# Altium project Irrigation_System.PrjPcb
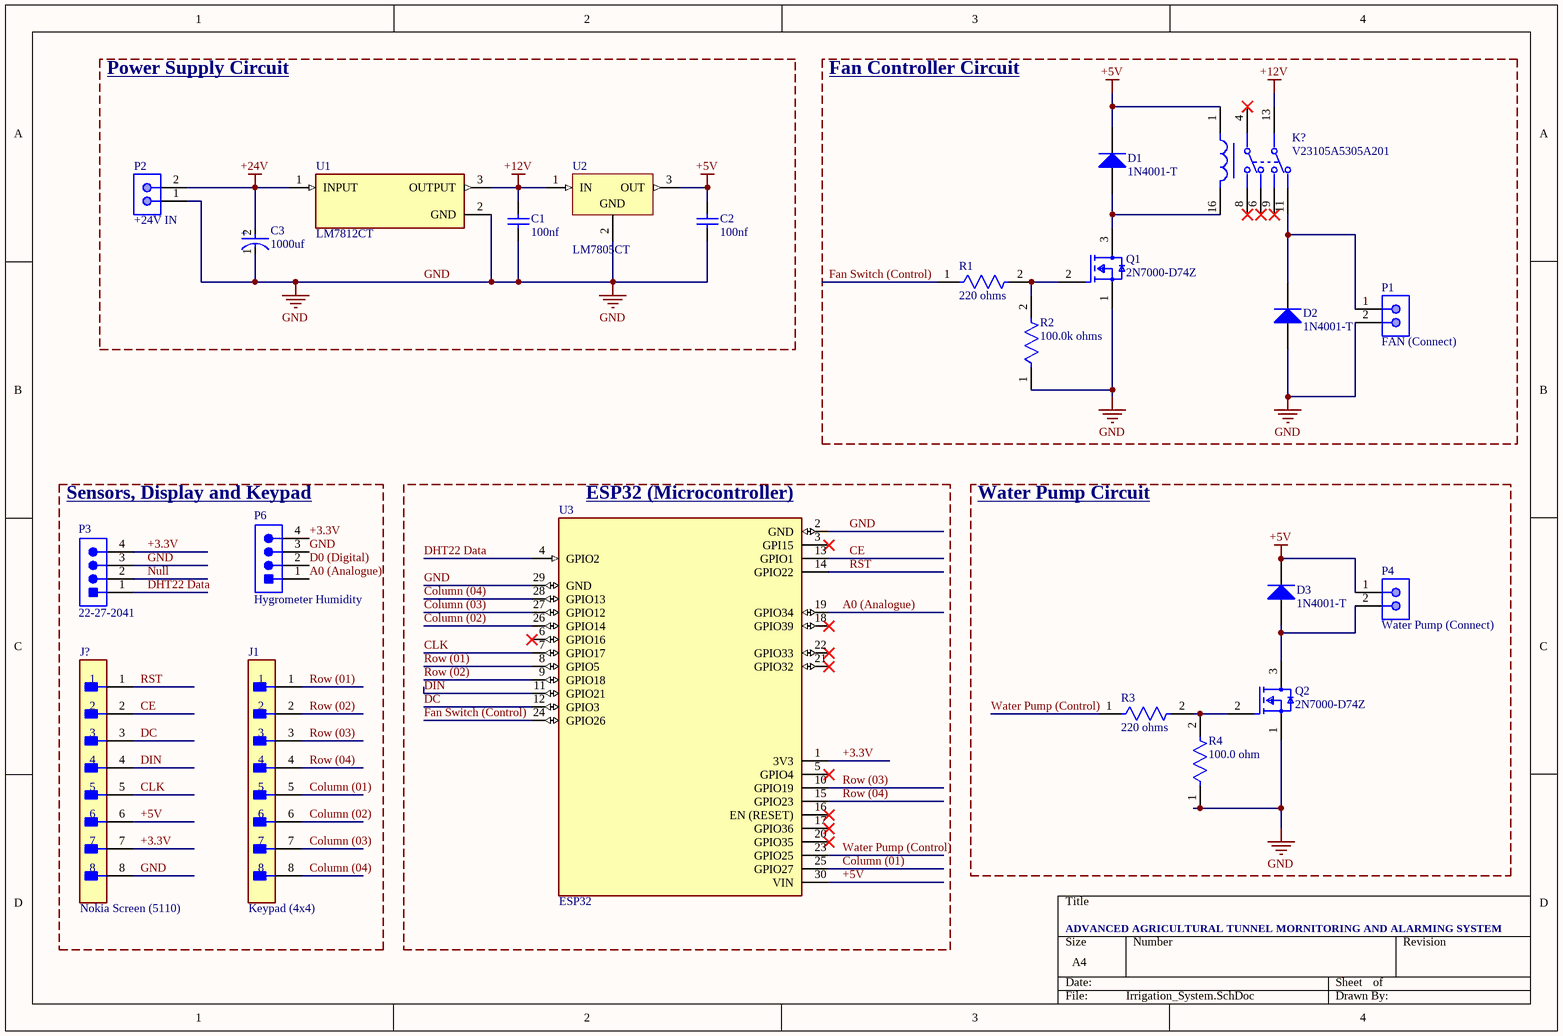
[diagram p0: Irrigation_System.SchDoc]
1 sheet, 23 parts. Net scope: global (net labels, ports and power ports of the same name join across sheets).
Board file: Irrigation_System.PcbDoc

## Sheet Irrigation_System.SchDoc
size A4; SheetNumber: 1; SheetTotal: 1

### Parts
C1  100nf  [CAPR51-254-508X318X736]
C2  100nf  [CAPR51-254-508X318X736]
C3  1000uf  [FP-RAD-TH-D_16_0_5-L_25_2-MFG]
D1  1N4001-T  [DIOD-DO-41-P-2_V]
D2  1N4001-T  [DIOD-DO-41-P-2_V]
D3  1N4001-T  [DIOD-DO-41-P-2_V]
J1  Keypad (4x4)  [FP-22-29-2081-MFG]
J?  Nokia Screen (5110)  [FP-22-29-2081-MFG]
K?  V23105A5305A201  [FP-V23105A5305A201-MFG]
P1  FAN (Connect)  [MOLX-22-27-2021_V]
P2  +24V IN  [MOLX-22-27-2021_V]
P3  22-27-2041  [MOLX-22-27-2041_V]
P4  Water Pump (Connect)  [MOLX-22-27-2021_V]
P6  Hygrometer Humidity  [MOLX-22-27-2041_V]
Q1  2N7000-D74Z  [FP-135AR-MFG]
Q2  2N7000-D74Z  [FP-135AR-MFG]
R1  220 ohms  [FP-MRS25-MFG]
R2  100.0k ohms  [FP-MRS25-MFG]
R3  220 ohms  [FP-MRS25-MFG]
R4  100.0 ohm  [FP-MRS25-MFG]
U1  LM7812CT  [FP-TO220B03-MFG]
U2  LM7805CT  [FAIR-TO-220-3]
U3  ESP32  [XCVR_ESP32-C3-DEVKITC-02]

### Blocks framed on the sheet
Power Supply Circuit: C1-C3 P2 U1 U2
Fan Controller Circuit: D1 D2 K? P1 Q1 R1 R2
Sensors, Display and Keypad: J1 J? P3 P6
ESP32 (Microcontroller): U3
Water Pump Circuit: D3 P4 Q2 R3 R4

### Nets
+5V: C2.2 D1.2(K) D3.2(K) J?.6 K?.1 P4.1 U2.3(OUT) U3.30(VIN)
+12V: C1.2 K?.13 U1.3(OUTPUT) U2.1(IN)
+24V: C3.2(A) P2.2 U1.1(INPUT)
GND: C1.1 C2.1 C3.1(C) D2.1(A) J?.8 P1.2 P2.1 P3.3 P6.3 Q1.1(Source) Q2.1(Source) R2.1 R4.1 U1.2(GND) U2.2(GND) U3.2(GND) U3.29(GND)
+3.3V: J?.7 P3.4 P6.4 U3.1(3V3)
A0 (Analogue): P6.1 U3.19(GPIO34)
CE: J?.2 U3.13(GPIO1)
CLK: J?.5 U3.7(GPIO17)
Column (01): J1.5 U3.25(GPIO27)
Column (02): J1.6 U3.26(GPIO14)
Column (03): J1.7 U3.27(GPIO12)
Column (04): J1.8 U3.28(GPIO13)
D0 (Digital): P6.2
DC: J?.3 U3.12(GPIO3)
DHT22 Data: P3.1 U3.4(GPIO2)
DIN: J?.4 U3.11(GPIO21)
Fan Switch (Control): R1.1 U3.24(GPIO26)
Null: P3.2
Row (01): J1.1 U3.8(GPIO5)
Row (02): J1.2 U3.9(GPIO18)
Row (03): J1.3 U3.10(GPIO19)
Row (04): J1.4 U3.15(GPIO23)
RST: J?.1 U3.14(GPIO22)
Water Pump (Control): R3.1 U3.23(GPIO25)
NetD1_1: D1.1(A) K?.16 Q1.3(Drain)
NetD2_2: D2.2(K) K?.11 P1.1
NetD3_1: D3.1(A) P4.2 Q2.3(Drain)
NetQ1_2: Q1.2(Gate) R1.2 R2.2
NetQ2_2: Q2.2(Gate) R3.2 R4.2

Not connected (* = marked no-connect by the designer): K? 4* 6* 8* 9*; U3 3(GPI15)* 5(GPIO4)* 6(GPIO16)* 16(EN_(RESET))* 17(GPIO36)* 18(GPIO39)* 20(GPIO35)* 21(GPIO32)* 22(GPIO33)*

### Notes on the sheet
- ADVANCED AGRICULTURAL TUNNEL MORNITORING AND ALARMING SYSTEM
- (in symbol CMP-05427-000487-1) +

### Library data of the parts
C1 C2 = CMP-1664-00004-1: Radial Leaded Multilayer Ceramic Capacitor, 0.1 uF, +/- 10%, 50 V, -55 to 125 degC, 2-Pin THD, RoHS, Tape and Reel; Case\Package: SOT-23-5; Max Power Dissipation: 250 mW; Output Current: 150 mA; Dropout Voltage: 260 mV; Outputs: 1; Output Voltage: 5 V; Max Input Voltage: 8 V; Min Operating Temperature: -40 degC; Packaging: Tape and Reel; Height: 1.3 mm; Radiation Hardening: No; Pins: 5; ComponentLink1Description: Manufacturer URL; Mount: Surface Mount; RoHSCompliant: true; Max Operating Temperature: 85 degC; PackageReference: CAPR51-254-508X318X736; ComponentLink2URL: http://www.kemet.com/docfinder?Partnumber=C320C104K5R5TA; PackageDescription: 2-Pin Through Hole Device, Body 5.08 x 3.18 mm, Pitch 2.54 mm; ComponentLink1URL: http://www.kemet.com/; Width: 1.8 mm; Package Quantity: 3000; DatasheetVersion: Dec-15; Length: 3 mm; ComponentLink2Description: Datasheet
C3 = CMP-05427-000487-1: Aluminum Electrolytic Capacitors (Radial Lead Type) 1000uF ±20% 50V; Ripple Current: 3.32A; Impedance: 16mR; Polarity: Polar; Life (Hours): 10000Hour; Capacitance: 1mF; Lead Diameter: 0.8mm; Mount: Through Hole; Series: FR; Package Quantity: 250; Length: 25mm; Radiation Hardening: No; REACH SVHC: No SVHC; Case/Package: Radial; Height: 25mm; Min Operating Temperature: -40°C; Contact Plating: Tin; Lead Free: Lead Free; Height - Seated (Max): 0.984inch; RoHS Compliant: Yes; Features: General Purpose; ESR (Equivalent Series Resistance): 16mR; Voltage Rating: 50V; Diameter: 16mm; Voltage Rating (DC): 50V; Max Operating Temperature: 105°C; Lead Pitch: 7.5mm; Packaging: Tape and Reel; Number of Pins: 2; Tolerance: 20%; Termination: Through Hole
D1-D3 = CMP-0639-00006-2: 1.0 A Rectifier, 15 pF, 50 V, -65 to 150 degC, 2-Pin DO-41 Plastic, RoHS, Tape and Reel; Manufacturer: Diodes Inc; VF (V): 1; CT (pF): 15; Max. IR (uA): 5; VRRM (V): 50; Max. IFSM (A): 30; RoHS: TRUE; Mounting Technology: Through Hole; PartNumber: 1N4001-T; ComponentLink2Description: Datasheet; DatasheetVersion: Rev. 8-2; Operating Temperature Range (degC): -65 to 150; Packing: Tape and Reel; PackageReference: DO-41-P-2; ComponentLink1URL: http://diodes.com/; PackageDescription: 2-Pin Axial Lead, Body 4.635 x 2.36 mm, Lead Spread 25.4 mm; ComponentLink2URL: http://diodes.com/datasheets/ds28002.pdf; Max. Average Rectified Current IO (A): 1; ComponentLink1Description: Manufacturer URL
J1 J? = CMP-00257-00277737-1: 22-29-2081 KK® 254 Wire-to-Board Header, Vertical, with Friction Lock, 8 Circuits, Gold (Au) Plating; NexarPartId: 277737; Contact Resistance: 10mΩ; Voltage Rating: 250V; Number of Positions: 8; Pitch: 2.54mm; Insulation Resistance: 50GΩ; Glow Wire Compliant: Non-compliant; Gender: Male; Current Rating: 4A; Number of Pins: 8; Lead Free: Lead Free; Color: White; Flammability Rating: UL94 V-0; REACH SVHC: Unknown; Height: 11.42mm; Housing Material: Nylon; Contact Plating: Gold; Packaging: Bulk; Min Operating Temperature: -40°C; Number of Contacts: 8; Voltage Rating (DC): 250V; Termination: Through Hole; Number of Rows: 1; Halogen Free: Low Halogen; Contact Material: Brass; Radiation Hardening: No; Max Operating Temperature: 75°C; Orientation: Vertical; Mount: Through Hole; Schedule B: 8536694040; Number of Circuits: 8; RoHS: Compliant; Lead Pitch: 2.54mm
K? = CMP-03395-000159-1: RELAY TELECOM DPDT 3A 24V; Manufacturer: TE Connectivity; Standoff Height: 0.2mm; Coil Type: Non-Latching; Number Of Contacts: 2; Coil Resistance: 2880Ω; Coil Power: 200mW; Switching Current: 3A; Device Class L1: Electromechanical; Automotive: No; Octopart: https://octopart.com/9-1393792-9-te+connectivity-41176539; Manufacturer Part Number: V23105A5305A201; ComponentLink2URL: https://www.te.com/commerce/DocumentDelivery/DDEController?Action=showdoc&DocId=Specification+Or+Standard%7F108-98007%7F1017%7Fpdf%7FEnglish%7FENG_SS_108-98007_1017.pdf%7F9-1393792-9; Lead Free: Yes; Temperature: -40°C to +85°C; Current Rating: 3A; Height: 10.9mm; Ambient Temperature Range High: +85°C; Ambient Temperature Range Low: -40°C; Category: Relay; RoHS: TRUE; Digikey Description: RELAY TELECOM DPDT 3A 24V; Package: V23105A5305A201; Device Class L3: Power Relays; Coil Voltage: 24V; Throw Configuration: DPDT; Temperature Range Low: -40°C; ComponentLink2Description: Datasheet; Temperature Range High: +85°C; Device Class L2: Relays
P1 P2 P4 = CMP-2000-05537-1: Male Header, Pitch 2.54 mm, 1 x 2 Position, Height 11.7 mm, Tail Length 3.56 mm, 0 to 75 degC, RoHS, Bulk; Manufacturer: Molex; PartNumber: 0022272021; Current rating: 4A; Package Version: Rev. BC, 02/2012; Voltage rating: 250V; No. of Positions: 2; Pitch: 2.54mm; No. of Rows: 1; Orientation: Vertical; Operating temperature: 0°Cto+75°C; Manufacturer URL: http://www.molex.com/; Mounting Technology: ThroughHole; Housing material: Nylon(UL94V-0); Package Description: 2-Leads Header, Body 5.08 x 5.8 mm, Pitch 2.54 mm; Voltage - Max: 250V; Datasheet URL: http://www.molex.com/pdm_docs/sd/022272021_sd.pdf; Package Reference: 22-27-2021; Contact material: Tinplatedbrass; Current - Max: 4A; Datasheet Version: Rev. F, 06/2009
P3 P6 = CMP-2000-05243-1: Male Header, Pitch 2.54 mm, 1 x 4 Position, Height 11.7 mm, Tail Length 3.56 mm, RoHS, Bulk; Manufacturer: Molex; Voltage rating: 250V; Current rating: 4A; Datasheet Version: Rev. F, 06/2009; Operating temperature: 0degCto+75degC; Contact material: Tinplatedbrass; Manufacturer URL: http://www.molex.com/; Housing material: Nylon(UL94V-0); Datasheet URL: http://www.molex.com/pdm_docs/sd/022272041_sd.pdf
Q1 Q2 = CMP-00278-84793556-1: 2N7000-D74Z 2N7000 Series 60V 5 Ohms N-Ch Enhancement Mode Field Effect Transistor - TO-92; Manufacturer Lifecycle Status: ACTIVE; Drain to Source Resistance: 1.2Ω; Power Dissipation: 400mW; Gate to Source Voltage (Vgs): 20V; Continuous Drain Current (ID): 200mA; Max Junction Temperature (Tj): 150°C; Number of Channels: 1; NexarPartId: 84793556; Min Operating Temperature: -55°C; Height: 8.77mm; Drain to Source Breakdown Voltage: 60V; RoHS: Compliant; Max Operating Temperature: 150°C; Lifecycle Status: Production; Schedule B: 8541210080; Drain to Source Voltage (Vdss): 60V
R1-R4 = CMP-00030-42632392-1: MRS25000C1002FCT00 Resistor, 10 kOhm, ± 1%, 600 mW, Axial Leaded, Metal Film (Thin Film), Professional; Power Rating: 600mW; Voltage Rating (DC): 350V; Lead Length: 26mm; Resistance: 10kΩ; Temperature Coefficient: 50ppm/°C; Termination: Axial; Number of Terminations: 2; Diameter: 2.5mm; Composition: Metal Film, Thin Film; Number of Pins: 2; Length: 6.5mm; Military Standard: Not; RoHS: Compliant; NexarPartId: 42632392; Width: 2.5mm; Radiation Hardening: No; Voltage Rating: 350V; Max Power Dissipation: 600mW; Min Operating Temperature: -55°C; Lead Free: Lead Free; Max Operating Temperature: 155°C; Tolerance: 1%; Schedule B: 8533210090, 8533210090; Contact Plating: Tin; Mount: Through Hole; REACH SVHC: Unknown; Case/Package: Conformal
U1 = CMP-07128-000015-1: IC REG LINEAR 12V 1A TO220-3; Obsolete Part: true; Manufacturer: ON Semiconductor; Nominal Supply Current: 5.1mA; Output Type: Fixed; Dropout Voltage: 2V; Max Supply Voltage: 35V; Accuracy Percentage: 4%; Standoff Height: 2.7mm; Number Of Outputs: 1; Octopart: https://octopart.com/lm7812ct-on+semiconductor-14383031; Output Current: 1A; ComponentLink2Description: Datasheet; Device Class L1: Integrated Circuits (ICs); Device Class L2: Power Management ICs; Temperature Range Low: -40°C; Category: IC; Package: TO220B03; Device Class L3: Voltage Regulators - Linear; RoHS: TRUE; Digikey Description: IC REG LINEAR 12V 1A TO220-3; Ipc Land Pattern Name: TO-220; Output Voltage: 12V; Temperature: -40°C to +125°C; Automotive: No; Temperature Range High: +125°C; ComponentLink2URL: https://www.mouser.in/datasheet/2/308/LM7812-1125088.pdf; Manufacturer Part Number: LM7812CT; Height: 20.4mm; Lead Free: Yes
U2 = CMP-2000-04938-1: Positive Voltage Regulator, 5 V, 1 A, -40 to 125 degC, 3-Pin TO-220, RoHS, Tube; Manufacturer: FairchildSemiconductor; Maximum Input Voltage: 35V; Maximum Quiescent Current: 8mA; Load Regulation: 100mV; Maximum Output Current: 2.2(Typ)A; Output Type: Fixed; Typical Dropout Voltage @ Current: 2@1AV; Rad Hard: No; Output Voltage: 5V; Accuracy: ±4%; Number of Outputs: 1; Category: LinearRegulator; Package Description: 3-Pin Through Hole Device, Body 10 x 4.5 mm, Pitch 2.54 mm; Packaging: Rail/Tube; Mounting: ThroughHole; Polarity: Positive; Manufacturer URL: https://www.fairchildsemi.com/; Line Regulation: 100mV; Datasheet Version: Aug-12; Datasheet URL: https://datasheet.ciiva.com/26904/lm7805ct-26904988.pdf; Package Reference: TO-220; Package URL: https://www.fairchildsemi.com/package-drawings/TO/TO220B03.pdf; Package: 3TO-220AB; Operating Temperature: -40to125degC; Type: Linear
U3 = ESP32-C3-DEVKITC-02: Development Boards & Kits - Wireless (Engineering Samples) ESP32-C3 General-Purpose Development Board, embeds ESP32-C3-WROOM-02, 4 MB Flash, with Pin Header; MF: Espressif Systems; Purchase-URL: https://pricing.snapeda.com/search/part/ESP32-C3-DevKitC-02/?ref=eda; Package: None; MP: ESP32-C3-DevKitC-02; Value: *; Price: None; Availability: In Stock; SnapEDA_Link: https://www.snapeda.com/parts/ESP32-C3-DevKitC-02/Espressif+Systems/view-part/?ref=snap; Check_prices: https://www.snapeda.com/parts/ESP32-C3-DevKitC-02/Espressif+Systems/view-part/?ref=eda